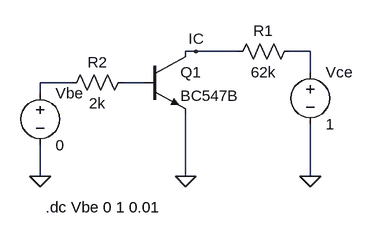
[diagram p0: schematic BJT character.asc]
BJT character.asc, the LTspice schematic file:
Version 4
SHEET 1 880 680
WIRE 256 96 240 96
WIRE 320 96 256 96
WIRE 432 96 400 96
WIRE 432 128 432 96
WIRE 64 144 16 144
WIRE 176 144 144 144
WIRE 16 160 16 144
WIRE 16 288 16 240
WIRE 240 288 240 192
WIRE 432 288 432 208
FLAG 432 288 0
FLAG 240 288 0
FLAG 16 288 0
FLAG 256 96 IC
SYMBOL npn 176 96 R0
SYMATTR InstName Q1
SYMATTR Value BC547B
SYMBOL res 416 80 R90
WINDOW 0 0 56 VBottom 2
WINDOW 3 32 56 VTop 2
SYMATTR InstName R1
SYMATTR Value 62k
SYMBOL voltage 432 112 R0
WINDOW 123 0 0 Left 2
WINDOW 39 0 0 Left 2
SYMATTR InstName Vce
SYMATTR Value 1
SYMBOL voltage 16 144 R0
WINDOW 123 0 0 Left 2
WINDOW 39 0 0 Left 2
SYMATTR InstName Vbe
SYMATTR Value 0
SYMBOL res 160 128 R90
WINDOW 0 0 56 VBottom 2
WINDOW 3 32 56 VTop 2
SYMATTR InstName R2
SYMATTR Value 2k
TEXT 24 336 Left 2 !.dc Vbe 0 1 0.01

The netlist it stands for:
* BJT character.asc
Q1 IC N003 0 0 BC547B
R1 N001 IC 62k
Vce N001 0 1
Vbe N002 0 0
R2 N003 N002 2k
.model NPN NPN
.model PNP PNP
.lib standard.bjt
.dc Vbe 0 1 0.01
.backanno
.end